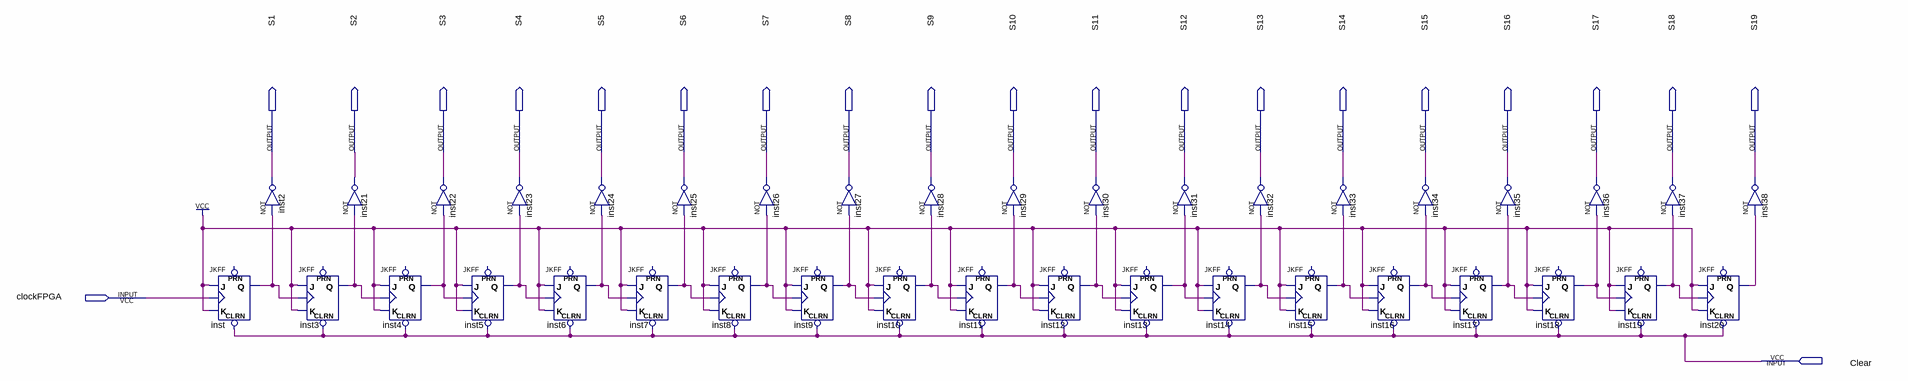
[diagram p0: schematic sheet]
// Quartus schematic contadorPulso.bdf as structural Verilog: 38 symbols, 21 pins
module contadorPulso (
  input  clockFPGA,
  input  Clear,
  output S1,
  output S2,
  output S3,
  output S4,
  output S5,
  output S6,
  output S7,
  output S8,
  output S9,
  output S10,
  output S11,
  output S12,
  output S13,
  output S14,
  output S15,
  output S16,
  output S17,
  output S18,
  output S19
);

  wire inst3_q, inst4_q, inst5_q, inst6_q, inst7_q, inst8_q, inst9_q, inst10_q, inst11_q, inst12_q, inst13_q,
       inst14_q, inst15_q, inst16_q, inst17_q, inst18_q, inst19_q, inst20_q, inst_q;

  JKFF inst (.CLRN(Clear), .K(1'b1), .J(1'b1), .CLK(clockFPGA), .Q(inst_q));  // open: PRN
  not inst2 (S1, inst_q);
  not inst21 (S2, inst3_q);
  JKFF inst3 (.CLRN(Clear), .K(1'b1), .J(1'b1), .CLK(inst_q), .Q(inst3_q));  // open: PRN
  JKFF inst4 (.CLRN(Clear), .K(1'b1), .J(1'b1), .CLK(inst3_q), .Q(inst4_q));  // open: PRN
  not inst22 (S3, inst4_q);
  JKFF inst5 (.CLRN(Clear), .K(1'b1), .J(1'b1), .CLK(inst4_q), .Q(inst5_q));  // open: PRN
  not inst23 (S4, inst5_q);
  JKFF inst6 (.CLRN(Clear), .K(1'b1), .J(1'b1), .CLK(inst5_q), .Q(inst6_q));  // open: PRN
  not inst24 (S5, inst6_q);
  JKFF inst7 (.CLRN(Clear), .K(1'b1), .J(1'b1), .CLK(inst6_q), .Q(inst7_q));  // open: PRN
  not inst25 (S6, inst7_q);
  JKFF inst8 (.CLRN(Clear), .K(1'b1), .J(1'b1), .CLK(inst7_q), .Q(inst8_q));  // open: PRN
  not inst26 (S7, inst8_q);
  JKFF inst9 (.CLRN(Clear), .K(1'b1), .J(1'b1), .CLK(inst8_q), .Q(inst9_q));  // open: PRN
  not inst27 (S8, inst9_q);
  JKFF inst10 (.CLRN(Clear), .K(1'b1), .J(1'b1), .CLK(inst9_q), .Q(inst10_q));  // open: PRN
  not inst28 (S9, inst10_q);
  not inst29 (S10, inst11_q);
  JKFF inst11 (.CLRN(Clear), .K(1'b1), .J(1'b1), .CLK(inst10_q), .Q(inst11_q));  // open: PRN
  JKFF inst12 (.CLRN(Clear), .K(1'b1), .J(1'b1), .CLK(inst11_q), .Q(inst12_q));  // open: PRN
  not inst30 (S11, inst12_q);
  JKFF inst13 (.CLRN(Clear), .K(1'b1), .J(1'b1), .CLK(inst12_q), .Q(inst13_q));  // open: PRN
  not inst31 (S12, inst13_q);
  JKFF inst14 (.CLRN(Clear), .K(1'b1), .J(1'b1), .CLK(inst13_q), .Q(inst14_q));  // open: PRN
  not inst32 (S13, inst14_q);
  JKFF inst15 (.CLRN(Clear), .K(1'b1), .J(1'b1), .CLK(inst14_q), .Q(inst15_q));  // open: PRN
  not inst33 (S14, inst15_q);
  JKFF inst16 (.CLRN(Clear), .K(1'b1), .J(1'b1), .CLK(inst15_q), .Q(inst16_q));  // open: PRN
  not inst34 (S15, inst16_q);
  JKFF inst17 (.CLRN(Clear), .K(1'b1), .J(1'b1), .CLK(inst16_q), .Q(inst17_q));  // open: PRN
  not inst35 (S16, inst17_q);
  JKFF inst18 (.CLRN(Clear), .K(1'b1), .J(1'b1), .CLK(inst17_q), .Q(inst18_q));  // open: PRN
  not inst36 (S17, inst18_q);
  not inst37 (S18, inst19_q);
  JKFF inst19 (.CLRN(Clear), .K(1'b1), .J(1'b1), .CLK(inst18_q), .Q(inst19_q));  // open: PRN
  JKFF inst20 (.CLRN(Clear), .K(1'b1), .J(1'b1), .CLK(inst19_q), .Q(inst20_q));  // open: PRN
  not inst38 (S19, inst20_q);
endmodule
